# EAGLE design HelvePicV1_0c (EAGLE 7.2.0)
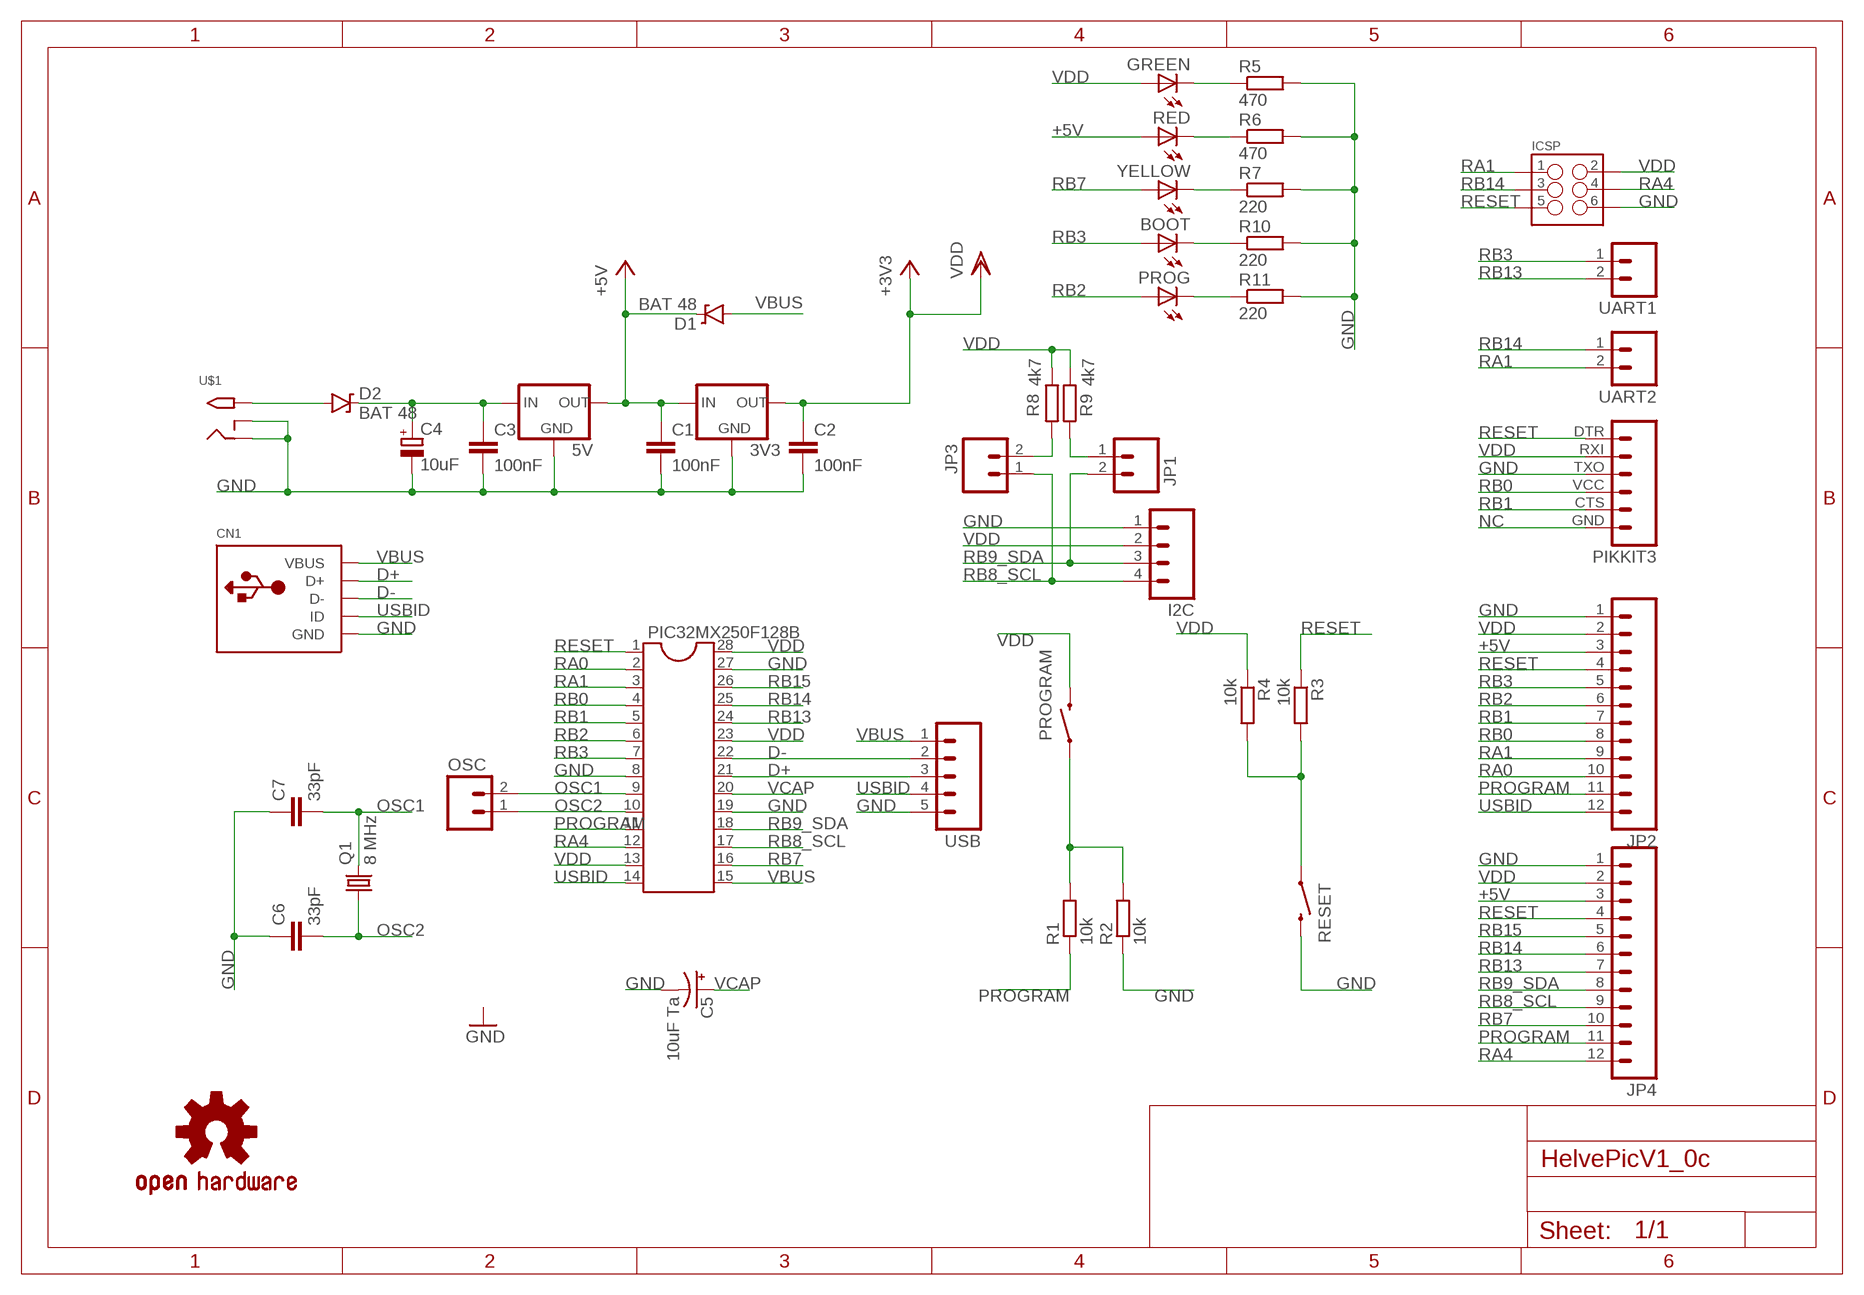
[diagram p0: schematic, sheet 1]

## Parts
3V3  MCP1700INLINE  [TO92-INLINE]
5V  MCP1700INLINE  [TO92-INLINE]
BOOT  LED3MM  [LED3MM]
C1  100nF  C-EU025-030X050  [C025-030X050]
C2  100nF  C-EU025-030X050  [C025-030X050]
C3  100nF  C-EU025-030X050  [C025-030X050]
C4  10uF  CPOL-EUE5-6  [E5-6]
C5  10uF Ta  CAP_POLPTH2  [CPOL-RADIAL-10UF-25V]
C6  33pF  C-EU025-030X050  [C025-030X050]
C7  33pF  C-EU025-030X050  [C025-030X050]
CN1  USBMOLEX  [USB-MINIB-THM-MOLEX]
D1  BAT 48  DIODE-ZENERPTH  [DIODE-ZENER]
D2  BAT 48  DIODE-ZENERPTH  [DIODE-ZENER]
GREEN  LED3MM  [LED3MM]
I2C  M04PTH  [1X04]
ICSP  M03X22X3_SILK_SM  [2X3]
JP1  M02PTH  [1X02]
JP2  M12PTH  [1X12]
JP3  M02PTH  [1X02]
JP4  M12PTH  [1X12]
LOGO1  OSHW-LOGOS  [OSHW-LOGO-S]
OSC  M02PTH  [1X02]
PIC32MX250F128B  DIL28-3  [DIL28-3]
PIKKIT3  M06SIP  [1X06]
PROG  LED3MM  [LED3MM]
PROGRAM  SWITCH-MOMENTARY-2PTH  [TACTILE-PTH]
Q1  8 MHz  CRYSTALHC49U-V  [HC49U-V]
R1  10k  R-EU_0207/7  [0207/7]
R2  10k  R-EU_0207/7  [0207/7]
R3  10k  R-EU_0207/7  [0207/7]
R4  10k  R-EU_0207/7  [0207/7]
R5  470  R-EU_0207/7  [0207/7]
R6  470  R-EU_0207/7  [0207/7]
R7  220  R-EU_0207/7  [0207/7]
R8  4k7  R-EU_0207/7  [0207/7]
R9  4k7  R-EU_0207/7  [0207/7]
R10  220  R-EU_0207/7  [0207/7]
R11  220  R-EU_0207/7  [0207/7]
RED  LED3MM  [LED3MM]
RESET  SWITCH-MOMENTARY-2PTH  [TACTILE-PTH]
U$1  2.1MMJACKTHM  [PJ-102A]
UART1  M02PTH  [1X02]
UART2  M02PTH  [1X02]
USB  M05PTH  [1X05]
YELLOW  LED3MM  [LED3MM]

## Nets
+5V: 3V3.2(IN) 5V.3(OUT) C1.1 D1.P$1(C) JP2.3 JP4.3 RED.A
D+: CN1.D+ PIC32MX250F128B.21 USB.3
D-: CN1.D- PIC32MX250F128B.22 USB.2
GND: 3V3.1(GND) 5V.1(GND) C1.2 C2.2 C3.2 C4.- C5.2(-) C6.1 C7.1 CN1.GND I2C.1 ICSP.6 JP2.1 JP4.1 PIC32MX250F128B.8 PIC32MX250F128B.19 PIC32MX250F128B.27 PIKKIT3.TXO R2.1 R5.2 R6.2 R7.2 R10.2 R11.2 RESET.3 U$1.RING U$1.RING_SW USB.5
N$1: JP3.2 R8.2
N$2: GREEN.K(C) R5.1
N$3: R6.1 RED.K(C)
N$4: JP1.1 R9.2
N$5: D2.P$2(A) U$1.TIP
N$8: 5V.2(IN) C3.1 C4.+ D2.P$1(C)
N$9: PROGRAM.1 R1.2 R2.2
N$10: R3.2 R4.2 RESET.1
NC: PIKKIT3.GND
OSC1: C7.2 OSC.2 PIC32MX250F128B.9 Q1.2
OSC2: C6.2 OSC.1 PIC32MX250F128B.10 Q1.1
PROGRAM: JP2.11 JP4.11 PIC32MX250F128B.11 R1.1
RA0: JP2.10 PIC32MX250F128B.2
RA1: ICSP.1 JP2.9 PIC32MX250F128B.3 UART2.2
RA4: ICSP.4 JP4.12 PIC32MX250F128B.12
RB0: JP2.8 PIC32MX250F128B.4 PIKKIT3.VCC
RB1: JP2.7 PIC32MX250F128B.5 PIKKIT3.CTS
RB2: JP2.6 PIC32MX250F128B.6 PROG.A
RB3: BOOT.A JP2.5 PIC32MX250F128B.7 UART1.1
RB7: JP4.10 PIC32MX250F128B.16 YELLOW.A
RB8_SCL: I2C.4 JP3.1 JP4.9 PIC32MX250F128B.17
RB9_SDA: I2C.3 JP1.2 JP4.8 PIC32MX250F128B.18
RB13: JP4.7 PIC32MX250F128B.24 UART1.2
RB14: ICSP.3 JP4.6 PIC32MX250F128B.25 UART2.1
RB15: JP4.5 PIC32MX250F128B.26
RESET: ICSP.5 JP2.4 JP4.4 PIC32MX250F128B.1 PIKKIT3.DTR R3.1
USBID: CN1.ID JP2.12 PIC32MX250F128B.14 USB.4
VBUS: CN1.VBUS D1.P$2(A) PIC32MX250F128B.15 USB.1
VCAP: C5.1(+) PIC32MX250F128B.20
VDD: 3V3.3(OUT) C2.1 GREEN.A I2C.2 ICSP.2 JP2.2 JP4.2 PIC32MX250F128B.13 PIC32MX250F128B.23 PIC32MX250F128B.28 PIKKIT3.RXI PROGRAM.3 R4.1 R8.1 R9.1 ; supply symbol labelled +3V3
YELLOW: R7.1 YELLOW.K(C)
YELLOW1: BOOT.K(C) R10.1
YELLOW2: PROG.K(C) R11.1

## Library data of the parts
3V3 5V = adafruit:MCP1700: VOLTAGE REGULATOR
BOOT GREEN PROG RED YELLOW = led:LED: LED OSRAM: - CHIPLED LG R971, LG N971, LY N971, LG Q971, LY Q971, LO R971, LY R971 LH N974, LH R974 LS Q976, LO Q976, LY Q976 LO Q996 - Hyper CHIPLED LW Q18S LB Q993, LB Q99A, LB R99A - SideLED LS A670, LO A670, LY A670, LG A670, LP A670 LB A673, LV A673, LT A673, LW A673 LH A674 LY A675 LS A676, LA A676, LO A676, LY A676, LW A676 LS A679, LY A679, LG A679 - Hyper Micro SIDELED® LS Y876, LA Y876, LO Y876, LY Y876 LT Y87S - SmartLED LW L88C, LW L88S LB L89C, LB L89S, LG L890 LS L89K, LO L89K, LY L89K LS L896, LA L896, LO L896, LY L896 - TOPLED LS T670, LO T670, LY T670, LG T670, LP T670 LSG T670, LSP T670, LSY T670, LOP T670, LYG T670 LG T671, LOG T671, LSG T671 LB T673, LV T673, LT T673, LW T673 LH T674 LS T676, LA T676, LO T676, LY T676, LB T676, LH T676, LSB T676, LW T676 LB T67C, LV T67C, LT T67C, LS T67K, LO T67K, LY T67K, LW E67C LS E67B, LA E67B, LO E67B, LY E67B, LB E67C, LV E67C, LT E67C LW T67C LS T679, LY T679, LG T679 LS T770, LO T770, LY T770, LG T770, LP T770 LB T773, LV T773, LT T773, LW T773 LH T774 LS E675, LA E675, LY E675, LS T675 LS T776, LA T776, LO T776, LY T776, LB T776 LHGB T686 LT T68C, LB T68C - Hyper Mini TOPLED® LB M676 - Mini TOPLED Santana® LG M470 LS M47K, LO M47K, LY M47K Source: http://www.osram.convergy.de LUXEON: - LUMILED® LXK2-PW12-R00, LXK2-PW12-S00, LXK2-PW14-U00, LXK2-PW14-V00 LXK2-PM12-R00, LXK2-PM12-S00, LXK2-PM14-U00 LXK2-PE12-Q00, LXK2-PE12-R00, LXK2-PE12-S00, LXK2-PE14-T00, LXK2-PE14-U00 LXK2-PB12-K00, LXK2-PB12-L00, LXK2-PB12-M00, LXK2-PB14-N00, LXK2-PB14-P00, LXK2-PB14-Q00 LXK2-PR12-L00, LXK2-PR12-M00, LXK2-PR14-Q00, LXK2-PR14-R00 LXK2-PD12-Q00, LXK2-PD12-R00, LXK2-PD12-S00 LXK2-PH12-R00, LXK2-PH12-S00 LXK2-PL12-P00, LXK2-PL12-Q00, LXK2-PL12-R00 Source: www.luxeon.com KINGBRIGHT: KA-3528ASYC Source: www.kingbright.com
C1-C3 C6 C7 = rcl:C-EU: CAPACITOR, European symbol
C4 = rcl:CPOL-EU: POLARIZED CAPACITOR, European symbol
C5 = SparkFun-Capacitors:CAP_POL: Capacitor Polarized These are standard SMD and PTH capacitors. Normally 10uF, 47uF, and 100uF in electrolytic and tantalum varieties. Always verify the external diameter of the through hole cap, it varies with capacity, voltage, and manufacturer. The EIA devices should be standard.
CN1 = adafruit:USB: USB Connectors USBMINIB - Surface Mount Female Mini-B USB Connector 4UConnector: 06564 By microbuilder.eu Thru-hole RA Female Mini-B USB Connector 4UConnector: 18732 By ladyada.net
D1 D2 = SparkFun-DiscreteSemi:DIODE-ZENER: Zener Diode Production Part - 8199 3.4V Zener Voltage
I2C = SparkFun-Connectors:M04: Header 4 Standard 4-pin 0.1" header. Use with straight break away headers (SKU : PRT-00116), right angle break away headers (PRT-00553), swiss pins (PRT-00743), machine pins (PRT-00117), and female headers (PRT-00115). Molex polarized connector foot print use with SKU : PRT-08231 with associated crimp pins and housings. 1MM SMD Version SKU: PRT-10208
ICSP = SparkFun-Connectors:M03X2: 2x3 .1" header. Shrouded, with keying- CONN-10681 SMT- CONN-11415 Pogo pins- HW-11044
JP1 JP3 OSC UART1 UART2 = SparkFun-Connectors:M02: Standard 2-pin 0.1" header. Use with - straight break away headers ( PRT-00116) - right angle break away headers (PRT-00553) - swiss pins (PRT-00743) - machine pins (PRT-00117) - female headers (PRT-00115) Molex polarized connector foot print use with: PRT-08233 with associated crimp pins and housings. 2.54_SCREWTERM for use with PRT-10571. 3.5mm Screw Terminal footprints for PRT-08084 5mm Screw Terminal footprints for use with PRT-08432
JP2 JP4 = SparkFun-Connectors:M12: Header 12 Standard 12-pin 0.1" header. Use with straight break away headers (SKU : PRT-00116), right angle break away headers (PRT-00553), swiss pins (PRT-00743), machine pins (PRT-00117), and female headers (PRT-00115).
LOGO1 = SparkFun-Aesthetics:OSHW-LOGO: Open Source Hardware Logo This logo indicates the piece of hardware it is found on incorporates a OSHW license and/or adheres to the definition of open source hardware found here: http://freedomdefined.org/OSHW
PIC32MX250F128B = ic-package:DIL28: Dual In Line
PIKKIT3 = SparkFun-Connectors:M06: Header 6 Standard 6-pin 0.1" header. Use with straight break away headers (SKU : PRT-00116), right angle break away headers (PRT-00553), swiss pins (PRT-00743), machine pins (PRT-00117), and female headers (PRT-00115). Molex polarized connector foot print use with SKU : PRT-08094 with associated crimp pins and housings. NOTES ON THE VARIANTS LOCK and LOCK_LONGPADS... This footprint was designed to help hold the alignment of a through-hole component (i.e. 6-pin header) while soldering it into place. You may notice that each hole has been shifted either up or down by 0.005 of an inch from it's more standard position (which is a perfectly straight line). This slight alteration caused the pins (the squares in the middle) to touch the edges of the holes. Because they are alternating, it causes a "brace" to hold the component in place. 0.005 has proven to be the perfect amount of "off-center" position when using our standard breakaway headers. Although looks a little odd when you look at the bare footprint, once you have a header in there, the alteration is very hard to notice. Also,if you push a header all the way into place, it is covered up entirely on the bottom side. This idea of altering the position of holes to aid alignment will be further integrated into the Sparkfun Library for other footprints. It can help hold any component with 3 or more connection pins.
PROGRAM RESET = SparkFun-Electromechanical:SWITCH-MOMENTARY-2: Various NO switches- pushbuttons, reed, etc
Q1 = adafruit:CRYSTAL: CRYSTAL; OC_FARNELL: 1666969; OC_NEWARK: unknown
R1-R11 = rcl:R-EU_: RESISTOR, European symbol
U$1 = adafruit:2.1MMJACK: 2.1mm x 5.5mm THM DC jack with internal switch. Digikey part #PJ-102A, 4UCON part #05537 2.1mm x 5.5mm SMT DC jack with internal switch. Digikey part #PJ-002A-SMT, 4UCON part #03267 By microbuilder.eu & adafruit.com
USB = SparkFun-Connectors:M05: Header 5 Standard 5-pin 0.1" header. Use with straight break away headers (SKU : PRT-00116), right angle break away headers (PRT-00553), swiss pins (PRT-00743), machine pins (PRT-00117), and female headers (PRT-00115). Molex polarized connector foot print use with SKU : PRT-08230 with associated crimp pins and housings.

## Board
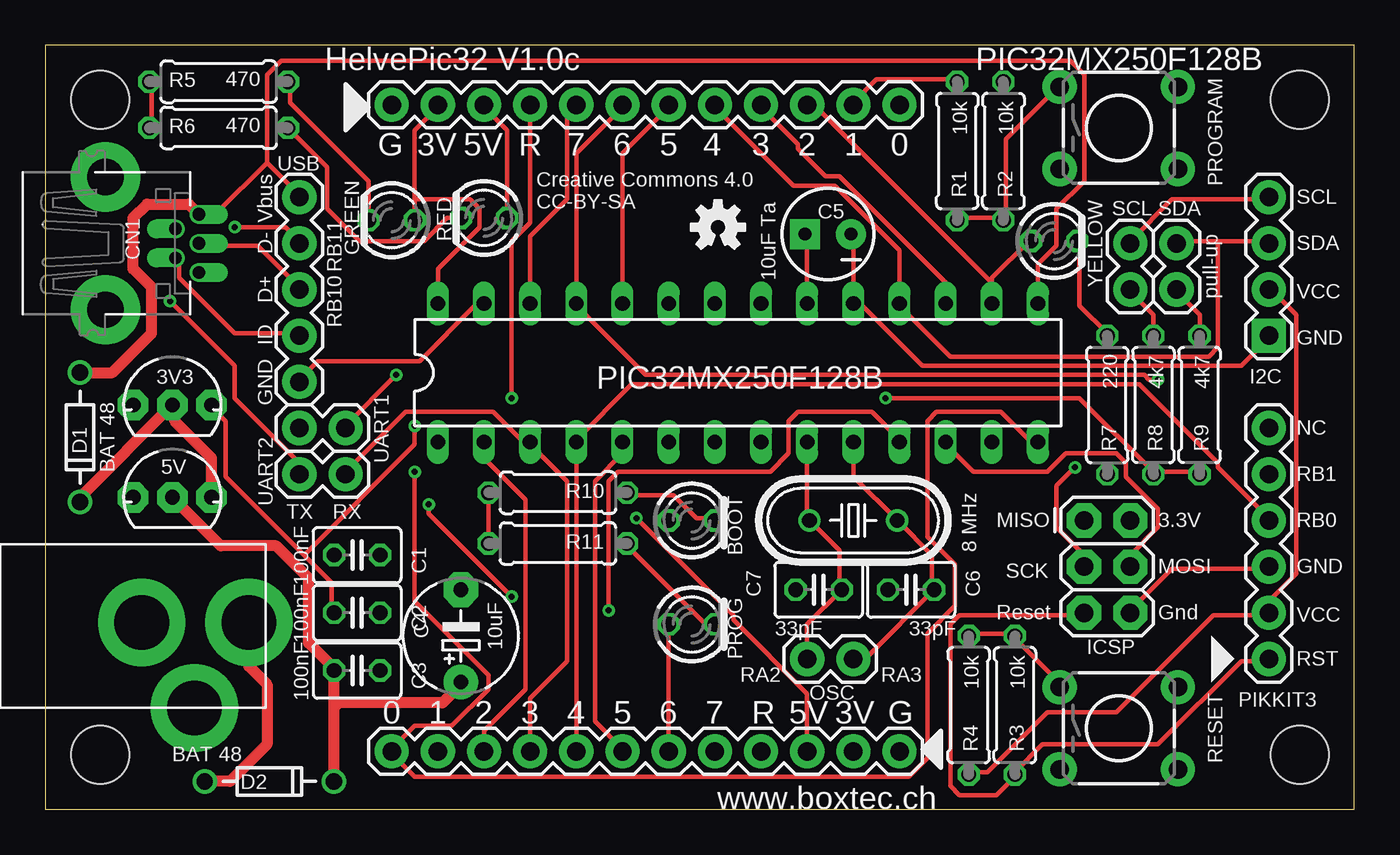
[diagram p1: board, top side]
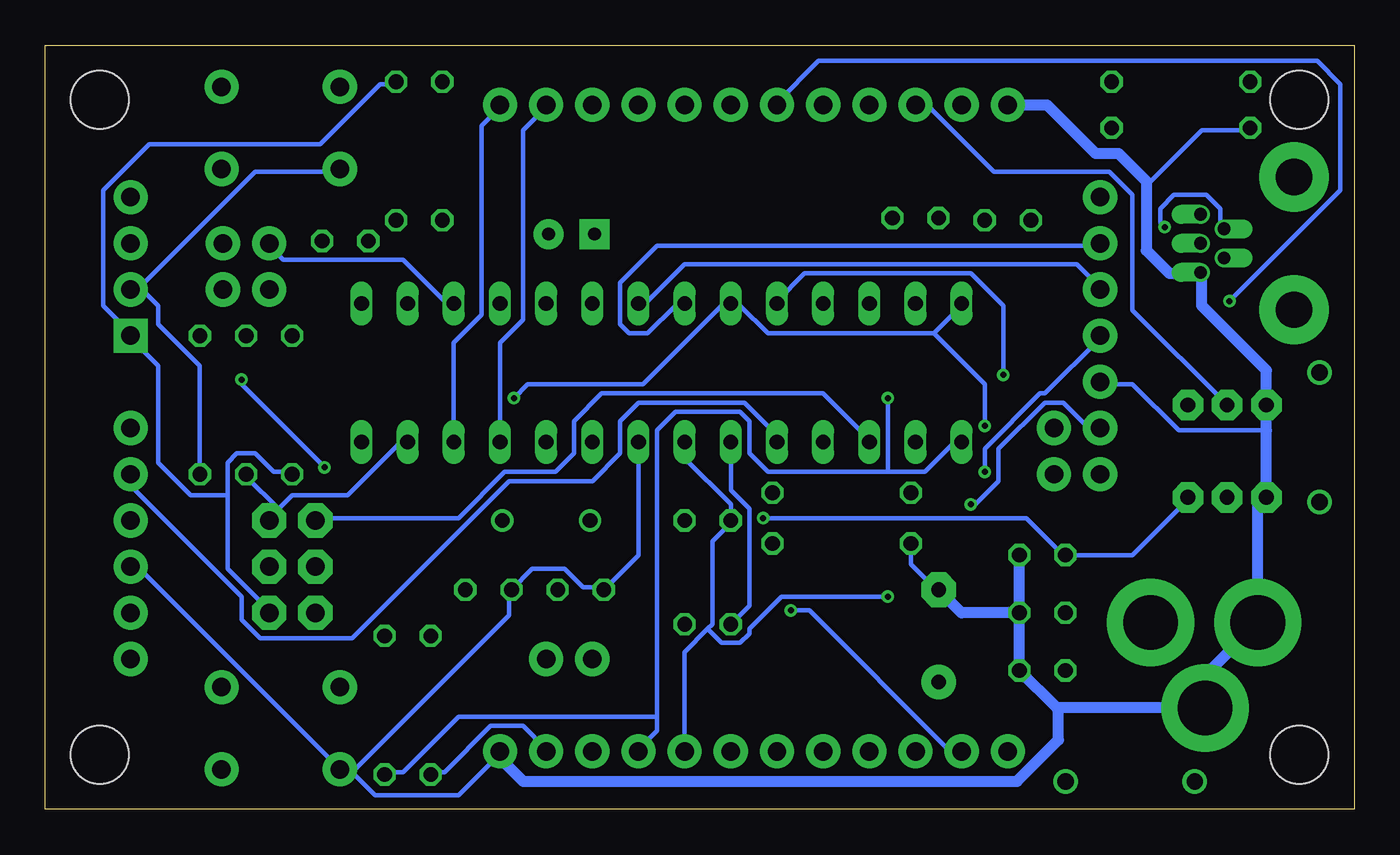
[diagram p2: board, bottom side, seen from below]

Size 72 x 42 mm. Coordinates in mm from the lower left corner, seen from the top.
Outline: 0,0 72,0 72,42 0,42 0,0
Copper layers (1*16): Top 0.0356mm / dielectric 1.5011mm / Bottom 0.0356mm
Design rules "LaenPCBOrder *": minimum track width 10mil, minimum drill 13mil, track to track 10mil, track to pad 10mil, pad to pad 10mil, via to via 10mil, smd to smd 10mil, copper to edge 15mil, drill to drill 6mil, minimum pad ring 7mil, minimum via ring 7mil, stop-mask expansion 4mil, vias tented up to drill 0mil, thermal gap 10mil
Holes 3.2 mm at 3,3 69,3 69,39 3,39

### Footprints (pad centres in the part's own frame; a part is rotated, then mirrored left to right if it is on the bottom)
TO92-INLINE = drill 0.813 pad 1.676 octagon: 1 -2.159,0; 2 0,0; 3 2.159,0
LED3MM = drill 0.813 octagon: A -1.27,0; K 1.27,0
C025-030X050 = drill 0.813 octagon: 1 -1.27,0; 2 1.27,0
E5-6 = drill 0.813 pad 1.905: + -2.54,0 | drill 0.813 pad 1.905 octagon: - 2.54,0
CPOL-RADIAL-10UF-25V = drill 0.7 pad 1.651 square: 1 1.27,0 | drill 0.7 pad 1.651: 2 -1.27,0
USB-MINIB-THM-MOLEX = drill 0.7 offset: D+ 0,9.72; D- -0.8,8.42; GND 1.6,9.72; ID 0.8,8.42; VBUS -1.6,9.72 | drill 2 pad 3.81: GND1 -3.65,4.57; GND4 3.65,4.57
DIODE-ZENER = drill 0.9: P$1 -3.556,0; P$2 3.556,0
1X04 = drill 1.016 pad 1.88 square: 1 0,0 | drill 1.016 pad 1.88: 2 2.54,0; 3 5.08,0; 4 7.62,0
2X3 = drill 1.016 pad 1.88 octagon: 1 0,0; 2 0,2.54; 3 2.54,0; 4 2.54,2.54; 5 5.08,0; 6 5.08,2.54
1X02 = drill 1.016 pad 1.88: 1 0,0; 2 2.54,0
1X12 = drill 1.016 pad 1.88: 1 0,0; 2 2.54,0; 3 5.08,0; 4 7.62,0; 5 10.16,0; 6 12.7,0; 7 15.24,0; 8 17.78,0; 9 20.32,0; 10 22.86,0; 11 25.4,0; 12 27.94,0
DIL28-3 = drill 0.813 long: 1 -16.51,-3.81; 2 -13.97,-3.81; 3 -11.43,-3.81; 4 -8.89,-3.81; 5 -6.35,-3.81; 6 -3.81,-3.81; 7 -1.27,-3.81; 8 1.27,-3.81; 9 3.81,-3.81; 10 6.35,-3.81; 11 8.89,-3.81; 12 11.43,-3.81; 13 13.97,-3.81; 14 16.51,-3.81; 15 16.51,3.81; 16 13.97,3.81; 17 11.43,3.81; 18 8.89,3.81; 19 6.35,3.81; 20 3.81,3.81; 21 1.27,3.81; 22 -1.27,3.81; 23 -3.81,3.81; 24 -6.35,3.81; 25 -8.89,3.81; 26 -11.43,3.81; 27 -13.97,3.81; 28 -16.51,3.81
1X06 = drill 1.016 pad 1.88: CTS 10.16,0; DTR 0,0; GND 12.7,0; RXI 2.54,0; TXO 5.08,0; VCC 7.62,0
TACTILE-PTH = drill 1.016 pad 1.88: 1 -3.251,2.261; 2 3.251,2.261; 3 -3.251,-2.261; 4 3.251,-2.261
HC49U-V = drill 0.813: 1 -2.413,0; 2 2.413,0
0207/7 = drill 0.813 octagon: 1 -3.81,0; 2 3.81,0
PJ-102A = drill 3 pad 4.8: RING 0.1,-3.39; RING_SW -4.6,-6.29; TIP 0.1,-9.29
1X05 = drill 1.016 pad 1.88: 1 0,0; 2 2.54,0; 3 5.08,0; 4 7.62,0; 5 10.16,0

### Placement (x,y rotation side)
3V3  6.99,22.23 0 top
5V  6.99,17.14 0 top
BOOT  35.56,15.88 0 top
C1  17.15,13.97 0 top
C2  17.15,10.79 0 top
C3  17.15,7.62 0 top
C4  22.86,9.53 90 top
C5  43.05,31.62 180 top
C6  47.63,12.06 0 top
C7  42.55,12.06 0 top
CN1  -1.27,31.11 270 top
D1  1.91,20.45 90 top
D2  12.32,1.52 180 top
GREEN  19.05,32.38 180 top
I2C  67.31,26.04 90 top
ICSP  57.15,15.88 270 top
JP1  62.23,28.57 90 top
JP2  46.99,3.17 180 top
JP3  59.69,31.11 270 top
JP4  19.05,38.73 0 top
LOGO1  37,32 0 top
OSC  44.45,8.26 180 top
PIC32MX250F128B  38.1,24 0 top
PIKKIT3  67.31,8.26 90 top
PROG  35.56,10.16 0 top
PROGRAM  59.06,37.47 0 top
Q1  44.45,15.88 180 top
R1  50.17,36.2 270 top
R2  52.71,36.2 270 top
R3  53.34,5.71 90 top
R4  50.8,5.71 90 top
R5  9.53,40.01 180 top
R6  9.53,37.47 180 top
R7  58.42,22.23 270 top
R8  60.96,22.23 90 top
R9  63.5,22.23 90 top
R10  28.2,17.4 180 top
R11  28.2,14.61 180 top
RED  24.13,32.51 180 top
RESET  59.06,4.45 0 top
U$1  1.91,10.16 90 top
UART1  13.97,20.95 0 top
UART2  13.97,18.41 0 top
USB  13.97,33.66 270 top
YELLOW  55.5,31.24 0 top

### Tracks (layer width: path | path; a pad name or v marks a point on that pad's centre or on a via)
+5V  (via drill 0.33)
  Top 0.254: RED.A 25.4,37.34 24.13,38.61 JP4.3 | JP2.3 41.91,6.35 37.85,10.41 37.85,10.67 v32.51,16
  Top 0.61: 5V.3 9.15,19.3 7.11,21.34 7.11,22.1 3V3.2 1.91,17.14 D1.P$1
  Bottom 0.254: 5V.3 9.15,17.02 12.19,13.97 C1.1 16,13.97 18.04,16 v32.51,16 | 3V3.2 12.19,27.43 12.19,33.78 13.46,35.05 19.81,35.05 23.37,38.61 24.13,38.61 JP4.3
D+
  Top 0.254: CN1.D+ 8.64,30.99 11.69,30.99 13.97,28.7 USB.3
  Bottom 0.254: PIC32MX250F128B.21 39.37,27.94 38.86,27.94 36.83,29.97 15.24,29.97 13.97,28.7 USB.3
D-  (via drill 0.33)
  Top 0.254: v10.42,32 13.21,32 13.97,31.24 USB.2
  Bottom 0.254: v10.42,32 10.67,32.26 10.67,33.02 9.91,33.78 8.13,33.78 7.37,33.02 7.37,32 CN1.D- | PIC32MX250F128B.22 36.83,27.69 37.34,27.69 38.86,26.16 39.88,26.16 40.39,26.67 40.39,28.96 38.36,30.99 13.97,30.99 USB.2
GND
  Top 0.254: PIKKIT3.TXO 67.31,13.21 61.98,13.21 59.69,10.92 ICSP.6 | C5.2 44.45,31.5 PIC32MX250F128B.19 44.45,27.69 44.96,27.69 48.26,24.38 65.79,24.38 67.31,25.91 I2C.1 | PIC32MX250F128B.27 24.13,27.69 23.62,27.69 20.58,24.64 14.99,24.64 13.97,23.62 USB.5 | R10.2 R11.2 | R6.2 5.84,37.59 5.84,39.88 R5.2
  Bottom 0.254: 61.98,17.27 61.98,13.21 59.69,10.92 ICSP.6 | 61.98,17.27 61.98,19.05 61.47,19.56 60.45,19.56 59.44,18.54 58.42,18.54 R7.2 | R2.1 52.83,39.88 53.6,39.88 56.9,36.58 66.3,36.58 68.84,34.04 68.84,27.69 67.31,26.16 I2C.1 67.31,25.91 65.79,24.38 65.79,19.05 64.01,17.27 61.98,17.27 | PIC32MX250F128B.8 39.37,13.97 C7.1 41.4,12.19 42.42,12.19 43.44,13.21 45.21,13.21 C6.1 46.48,11.94 46.48,10.67 55.12,2.03 | R6.2 5.84,37.34 8.38,37.34 11.18,34.54 11.43,34.54 | R11.2 24.39,13.46 23.12,12.19 C4.- | 55.12,2.03 55.63,2.03 RESET.3 | 55.12,2.03 53.85,0.76 49.28,0.76 47.25,2.79 JP2.1 | 55.12,2.03 RESET.3 | 4.83,20.83 9.65,20.83 12.19,23.37 13.97,23.37 USB.5 | PIKKIT3.TXO 67.31,13.21 66.8,13.21 55.88,2.29 RESET.3
  Bottom 0.61: 16.26,5.56 U$1.RING_SW 8.2,7.36 U$1.RING 5.3,16.68 5V.1 4.83,20.83 3V3.1 4.83,24.13 8.38,27.69 8.38,29.45 CN1.GND 8.5,29.46 10.16,29.46 11.43,30.73 11.43,34.54 12.96,36.07 14.23,36.07 16.89,38.73 JP4.1 | 16.26,5.56 16.36,5.56 C3.2 C2.2 | C2.2 C1.2 | C2.2 21.59,10.79 C4.- | JP2.1 46.99,2.79 45.72,1.52 18.54,1.52 16.26,3.81 16.26,5.56
N$1
  Top 0.254: R8.2 60.96,27.18 59.69,28.45 JP3.2
N$2
  Top 0.254: GREEN.K 17.78,34.54 13.46,38.86 13.46,39.88 R5.1
N$3
  Top 0.254: RED.K 22.1,32.51 20.83,31.24 17.27,31.24 15.5,33.02 15.5,35.31 R6.1
N$4
  Top 0.254: R9.2 63.5,27.18 62.23,28.45 JP1.1
N$5
  Top 0.61: U$1.TIP 11.2,7.86 12.19,6.86 12.19,3.56 10.16,1.52 D2.P$2
N$8
  Top 0.61: D2.P$1 15.88,5.59 | 15.88,5.59 C3.1 15.88,7.75 14.48,9.14 14.48,12.7 12.7,14.48 9.65,14.48 5V.2 | C4.+ 22.86,6.86 21.85,5.84 16.13,5.84 15.88,5.59
N$9
  Top 0.254: R1.2 50.29,32.51 52.58,32.51 R2.2 52.83,32.51 52.83,36.83 55.63,39.62 PROGRAM.1
N$10
  Top 0.254: R4.2 50.8,9.65 53.34,9.65 R3.2 53.34,9.4 55.88,6.86 RESET.1
OSC1
  Top 0.254: PIC32MX250F128B.9 41.91,16 Q1.2 43.69,14.22 43.69,12.19 C7.2 41.91,10.16 OSC.2
OSC2
  Top 0.254: PIC32MX250F128B.10 44.45,18.29 Q1.1 48.77,13.97 48.77,12.19 C6.2 45.21,8.38 44.45,8.38 OSC.1
PROGRAM  (via drill 0.33)
  Top 0.254: R1.1 50.04,40.13 45.72,40.13 44.45,38.86 JP4.11 | v30.99,10.92 30.99,18.03 31.5,18.54 39.88,18.54 40.9,19.56 40.9,21.34 41.4,21.84 45.47,21.84 46.99,20.32 PIC32MX250F128B.11
  Bottom 0.254: PIC32MX250F128B.11 46.99,25.65 45.72,26.92 45.72,37.34 44.45,38.61 JP4.11 | v30.99,10.92 29.97,10.92 22.35,3.3 21.59,3.3 JP2.11
RA0
  Top 0.254: PIC32MX250F128B.2 24.13,19.3 26.42,17.02 26.42,6.6 24.13,4.32 JP2.10
RA1
  Top 0.254: UART2.2 16.51,18.54 19.81,21.84 24.64,21.84 26.16,20.32 26.67,20.32 PIC32MX250F128B.3 26.67,20.07 28.7,18.03 28.7,8.13 26.67,6.1 JP2.9
  Bottom 0.254: ICSP.1 57.15,16 49.28,16 46.74,18.54 43.94,18.54 42.93,19.56 42.93,21.34 41.4,22.86 29.21,22.86 26.67,20.32 PIC32MX250F128B.3
RA4
  Top 0.254: ICSP.4 59.69,13.97 61.22,15.49 61.22,16.51 59.44,18.29 59.44,19.05 58.93,19.56 56.14,19.56 55.12,18.54 51.06,18.54 49.53,20.07 PIC32MX250F128B.12
  Bottom 0.254: PIC32MX250F128B.12 49.53,25.65 48.01,27.18 48.01,37.59 46.99,38.61 JP4.12
RB0
  Top 0.254: JP2.8 PIC32MX250F128B.4 29.21,20.32 32.26,23.37 60.2,23.37 64.52,19.05 64.52,18.8 67.31,16 PIKKIT3.VCC
RB1
  Top 0.254: PIC32MX250F128B.5 31.75,19.56 30.23,18.03 30.23,4.83 31.75,3.3 JP2.7
  Bottom 0.254: PIKKIT3.CTS 67.31,17.78 61.22,11.68 61.22,10.41 60.2,9.4 55.12,9.4 46.48,18.03 41.91,18.03 40.39,19.56 40.39,21.34 39.37,22.35 33.53,22.35 31.75,20.57 PIC32MX250F128B.5
RB2
  Top 0.254: JP2.6 PROG.A
  Bottom 0.254: PIC32MX250F128B.6 34.29,17.53 33.28,16.51 33.28,11.18 PROG.A
RB3  (via drill 0.33)
  Top 0.254: v21.08,16.76 21.08,16.26 v25.66,11.68
  Bottom 0.254: PIC32MX250F128B.7 36.83,19.3 34.29,16.76 BOOT.A 34.29,15.75 35.31,14.73 35.31,10.16 35.56,9.91 | JP2.5 36.83,8.64 35.56,9.91 | v21.08,16.76 20.83,16.76 19.56,18.03 19.56,19.81 17.02,22.35 16,22.35 14.73,21.08 13.97,21.08 UART1.1 | v25.66,11.68 31.5,11.68 33.28,9.91 33.28,9.65 33.78,9.14 34.8,9.14 35.56,9.91
RB7
  Top 0.254: 52.07,28.96 52.07,29.21 54.1,31.24 YELLOW.A | 52.07,28.96 PIC32MX250F128B.16 52.07,27.94 | 52.07,28.96 42.42,38.61 41.91,38.61 JP4.10
RB8_SCL
  Top 0.254: I2C.4 67.31,33.53 61.98,33.53 59.69,31.24 JP3.1 | PIC32MX250F128B.17 49.53,28.96 43.69,34.8 42.93,34.8 41.4,36.32 41.4,36.58 39.37,38.61 JP4.9
  Bottom 0.254: PIC32MX250F128B.17 49.53,27.94 50.04,27.94 52.33,30.23 58.93,30.23 59.69,30.99 JP3.1
RB9_SDA
  Top 0.254: 64.52,31.24 67.31,31.24 I2C.3 | 64.52,31.24 62.23,31.24 JP1.2 | JP4.8 36.83,38.61 41.15,34.29 43.44,34.29 46.99,30.73 PIC32MX250F128B.18 46.99,27.69 49.79,24.89 64.01,24.89 64.52,25.4 64.52,31.24
RB13  (via drill 0.33)
  Top 0.254: PIC32MX250F128B.24 31.75,36.07 34.29,38.61 JP4.7 | v19.31,23.88 16.51,21.08 UART1.2
  Bottom 0.254: v19.31,23.88 19.31,27.69 21.08,29.46 30.23,29.46 31.75,27.94 PIC32MX250F128B.24
RB14  (via drill 0.33)
  Top 0.254: JP4.6 31.75,38.61 29.21,36.07 PIC32MX250F128B.25 29.21,27.69 33.02,23.88 60.45,23.88 60.71,23.62 v61.22,23.62 | ICSP.3 57.15,13.97 55.63,15.49 55.63,17.78 v56.64,18.8 | UART2.1 13.97,19.05 10.42,22.61 10.42,24.38 v6.86,27.94
  Bottom 0.254: v56.64,18.8 61.22,23.37 v61.22,23.62 | v6.86,27.94 0.76,34.04 0.76,39.88 2.03,41.15 29.47,41.15 31.75,38.86 JP4.6
RB15
  Top 0.254: PIC32MX250F128B.26 26.67,31.5 28.7,33.53 28.7,38.1 29.21,38.61 JP4.5
RESET  (via drill 0.33)
  Top 0.254: JP4.4 26.67,32.26 25.66,31.24 v25.66,22.61 | PIKKIT3.DTR 67.31,8.13 65.79,8.13 61.22,3.56 54.87,3.56 53.34,2.03 R3.1 53.34,1.78 52.33,0.76 50.29,0.76 49.79,1.27 49.79,10.16 50.29,10.67 57.15,10.67 ICSP.5
  Bottom 0.254: 25.66,18.54 32.26,18.54 33.28,19.56 33.28,21.34 33.78,21.84 37.34,21.84 38.36,20.83 38.36,5.08 | 25.66,18.54 23.62,18.54 22.1,20.07 21.59,20.07 PIC32MX250F128B.1 | 38.36,5.08 38.36,4.32 39.37,3.3 JP2.4 | 38.36,5.08 49.28,5.08 52.33,2.03 53.34,2.03 R3.1 | 25.66,18.54 v25.66,22.61
USBID  (via drill 0.33)
  Top 0.254: CN1.ID 7.37,30.23 7.37,29.21 10.42,26.16 13.97,26.16 USB.4 | PIC32MX250F128B.14 54.61,20.32 54.1,20.32 52.58,21.84 49.02,21.84 48.52,21.34 48.52,14.99 50.04,13.46 50.04,11.18 48.52,9.65 48.52,2.79 47.5,1.78 20.32,1.78 19.05,3.05 JP2.12 19.05,3.3 20.32,4.57 22.35,4.57 24.39,6.6 24.39,7.37 20.32,11.43 v20.32,18.54
  Bottom 0.254: v20.32,18.54 20.32,19.81 17.27,22.86 17.02,22.86 13.97,25.91 USB.4
VBUS
  Top 0.254: PIC32MX250F128B.15 54.61,29.97 55.63,30.99 55.63,33.02 57.15,34.54 57.15,40.39 56.39,41.15 12.96,41.15 12.19,40.39 12.19,35.56 | 12.19,35.56 13.97,33.78 USB.1 | 12.19,35.56 9.4,32.77 8.64,32.77 CN1.VBUS
  Top 0.61: D1.P$2 3.68,24 5.84,26.16 5.84,28.7 4.83,29.72 4.83,32.51 5.59,33.27 7.89,33.27 CN1.VBUS
VCAP
  Top 0.254: PIC32MX250F128B.20 41.91,31.5 C5.1
VDD  (via drill 0.33)
  Top 0.254: 14.23,13.97 9.91,18.29 9.91,21.34 9.15,22.1 3V3.3 | 14.23,13.97 15.75,12.45 15.75,10.92 C2.1 | 20.32,33.53 20.32,37.34 21.59,38.61 JP4.2 | 20.32,33.53 GREEN.A | PIC32MX250F128B.28 21.59,29.72 23.88,32 23.88,33.02 23.37,33.53 20.32,33.53 | 14.23,13.97 20.32,20.07 v20.32,21.08 | 60.96,18.54 63.5,18.54 R9.1 | I2C.2 67.31,28.7 68.84,27.18 68.84,12.95 67.31,11.43 PIKKIT3.RXI 67.31,10.67 64.26,10.67 58.93,5.33 55.12,5.33 51.82,2.03 50.8,2.03 R4.1 | v46.23,22.61 56.9,22.61 60.96,18.54 | 60.96,18.54 R8.1
  Bottom 0.254: 34.29,27.69 33.78,27.69 32.26,26.16 23.12,26.16 | 23.12,26.16 21.59,27.69 PIC32MX250F128B.28 | v20.32,21.08 20.32,23.37 23.12,26.16 | 59.18,16.51 59.69,16 ICSP.2 59.18,16.51 | 59.18,16.51 58.42,17.27 55.37,17.27 52.58,20.07 52.07,20.07 PIC32MX250F128B.13 | 59.18,16.51 60.96,18.29 R8.1 | R4.1 50.8,2.03 50.04,2.03 47.5,4.57 45.72,4.57 44.45,3.3 JP2.2 | 66.8,28.7 60.45,35.05 55.88,35.05 PROGRAM.3 | 66.8,28.7 67.31,28.7 I2C.2 66.8,28.7 | R9.1 63.5,24.38 65.79,26.67 65.79,27.69 66.8,28.7 | 34.29,27.69 34.8,27.69 39.12,23.37 45.47,23.37 v46.23,22.61 | 34.29,27.69 PIC32MX250F128B.23
YELLOW
  Top 0.254: YELLOW.K 56.9,31.24 56.9,27.69 58.42,26.16 R7.1
YELLOW1
  Top 0.254: BOOT.K 36.83,16 35.82,16 34.55,17.27 32.01,17.27 R10.1
YELLOW2
  Top 0.254: PROG.K 36.32,10.16 32.01,14.48 R11.1

### Text on the board
tNames: HelvePic32 V1.0c | PIC32MX250F128B | G | 3V | 5V | R | 7 | 6 | 5 | 4 | 3 | 2 | 1 | 0 | Vbus | Creative Commons 4.0 / CC-BY-SA | SCL | SDA | SCL | D- | RB11 | SDA | D+ | RB10 | pull-up | VCC | ID | GND | GND | NC | RB1 | TX | RX | MISO | 3.3V | RB0 | SCK | MOSI | GND | Reset | Gnd | VCC | RST | RA2 | RA3 | 0 | 1 | 2 | 3 | 4 | 5 | 6 | 7 | R | 5V | 3V | G | www.boxtec.ch